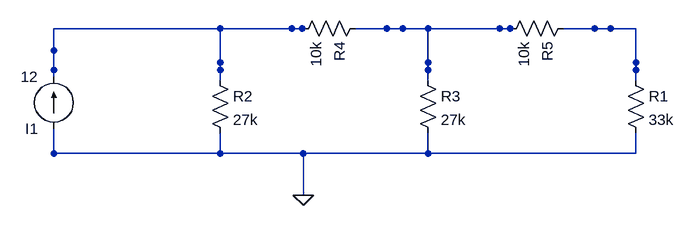
[diagram p0: schematic pannel4_solution.asc]
pannel4_solution.asc, the LTspice schematic file:
Version 4
SHEET 1 880 680
WIRE 448 400 448 372
WIRE 448 512 448 480
SYMBOL res 432 384 R0
SYMATTR InstName R2
SYMATTR Value 27k
WIRE 768 400 768 372
WIRE 768 512 768 480
SYMBOL res 752 384 R0
SYMATTR InstName R3
SYMATTR Value 27k
WIRE 1088 400 1088 372
WIRE 1088 512 1088 480
SYMBOL res 1072 384 R0
SYMATTR InstName R1
SYMATTR Value 33k
WIRE 656 320 729 320
WIRE 558 320 574 320
SYMBOL res 672 304 R90
SYMATTR InstName R4
SYMATTR Value 10k
WIRE 976 320 1049 320
WIRE 878 320 894 320
SYMBOL res 992 304 R90
SYMATTR InstName R5
SYMATTR Value 10k
WIRE 192 474 192 514
WIRE 192 354 192 394
SYMBOL current 192 474 R180
SYMATTR InstName I1
SYMATTR Value 12
FLAG 576 576 0
WIRE 192 512 256 512
WIRE 448 512 512 512
WIRE 384 512 448 512
WIRE 768 512 832 512
WIRE 704 512 768 512
WIRE 1024 512 1088 512
WIRE 1088 320 1088 384
WIRE 1024 320 1088 320
WIRE 768 320 768 384
WIRE 768 320 832 320
WIRE 704 320 768 320
WIRE 448 320 448 384
WIRE 448 320 512 320
WIRE 384 320 448 320
WIRE 192 320 192 384
WIRE 192 320 256 320
WIRE 576 512 576 576
WIRE 512 512 576 512
WIRE 576 512 640 512
WIRE 256 512 320 512
WIRE 320 512 384 512
WIRE 640 512 704 512
WIRE 832 512 896 512
WIRE 896 512 960 512
WIRE 960 512 1024 512
WIRE 832 320 896 320
WIRE 512 320 576 320
WIRE 320 320 384 320
WIRE 256 320 320 320

The netlist it stands for:
* pannel4_solution.asc
R2 N001 0 27k
R3 N002 0 27k
R1 N003 0 33k
R4 N002 N001 10k
R5 N003 N002 10k
I1 0 N001 12
.backanno
.end